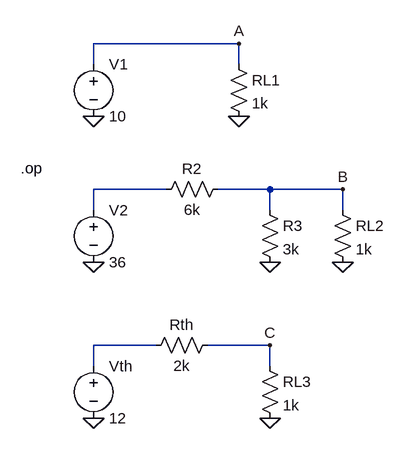
[diagram p0: schematic Diodo 1-aproximacao.asc]
Diodo 1-aproximacao.asc, the LTspice schematic file:
Version 4
SHEET 1 880 680
WIRE 288 -64 64 -64
WIRE 64 -32 64 -64
WIRE 288 -32 288 -64
WIRE 176 160 64 160
WIRE 336 160 256 160
WIRE 448 160 336 160
WIRE 64 192 64 160
WIRE 336 192 336 160
WIRE 448 192 448 160
WIRE 160 400 64 400
WIRE 336 400 240 400
WIRE 64 432 64 400
WIRE 336 432 336 400
FLAG 64 48 0
FLAG 288 48 0
FLAG 64 272 0
FLAG 336 272 0
FLAG 448 272 0
FLAG 64 512 0
FLAG 336 512 0
FLAG 288 -64 A
FLAG 448 160 B
FLAG 336 400 C
SYMBOL voltage 64 -48 R0
SYMATTR InstName V1
SYMATTR Value 10
SYMBOL voltage 64 176 R0
SYMATTR InstName V2
SYMATTR Value 36
SYMBOL voltage 64 416 R0
SYMATTR InstName Vth
SYMATTR Value 12
SYMBOL res 272 -48 R0
SYMATTR InstName RL1
SYMATTR Value 1k
SYMBOL res 272 144 R90
WINDOW 0 0 56 VBottom 2
WINDOW 3 32 56 VTop 2
SYMATTR InstName R2
SYMATTR Value 6k
SYMBOL res 320 176 R0
SYMATTR InstName R3
SYMATTR Value 3k
SYMBOL res 432 176 R0
SYMATTR InstName RL2
SYMATTR Value 1k
SYMBOL res 320 416 R0
SYMATTR InstName RL3
SYMATTR Value 1k
SYMBOL res 256 384 R90
WINDOW 0 0 56 VBottom 2
WINDOW 3 32 56 VTop 2
SYMATTR InstName Rth
SYMATTR Value 2k
TEXT -48 128 Left 2 !.op

The netlist it stands for:
* Diodo 1-aproximacao.asc
V1 A 0 10
V2 N001 0 36
Vth N002 0 12
RL1 A 0 1k
R2 B N001 6k
R3 B 0 3k
RL2 B 0 1k
RL3 C 0 1k
Rth C N002 2k
.op
.backanno
.end